# Altium schematic sheet DC075B_CW_OUTPUTS.SchDoc: CW OUTPUTS
size 558 x 431 mm; DrawnBy: Praveen Aroul; DocumentNumber: 12; SheetNumber: 12; SheetTotal: 13; PageSetup: Record=PageOptions|CenterHorizontal=True|CenterVertical=True|PrintScale=1.00|XCorrection=1.00|YCorrection=1.00|PrintKind=0|BorderSize=5000000|LeftOffset=0|BottomOffset=0|Orientation=2|PaperLength=1000|PaperWidth=1000|Scale=100|PaperSource=15|PrintQuality=600|MediaType=1|DitherType=10|PaperKind=Letter|PrintScaleMode=1
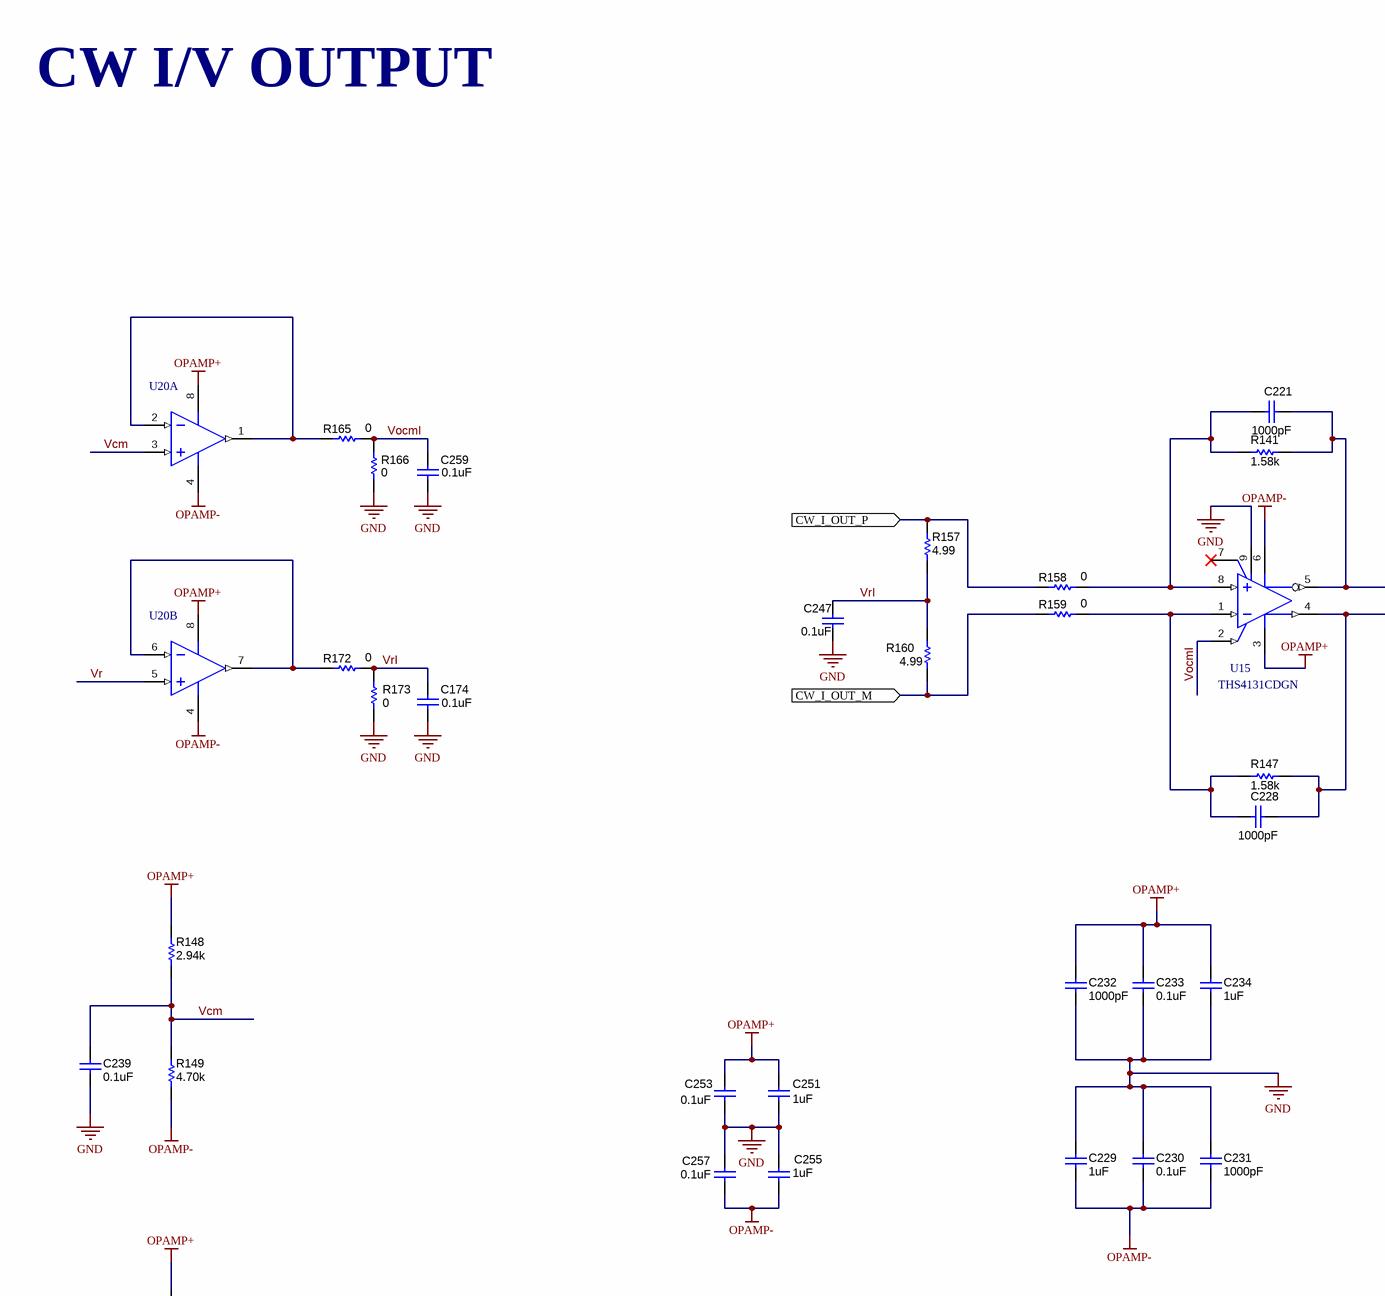
[diagram p0: DC075B_CW_OUTPUTS.SchDoc, top left]
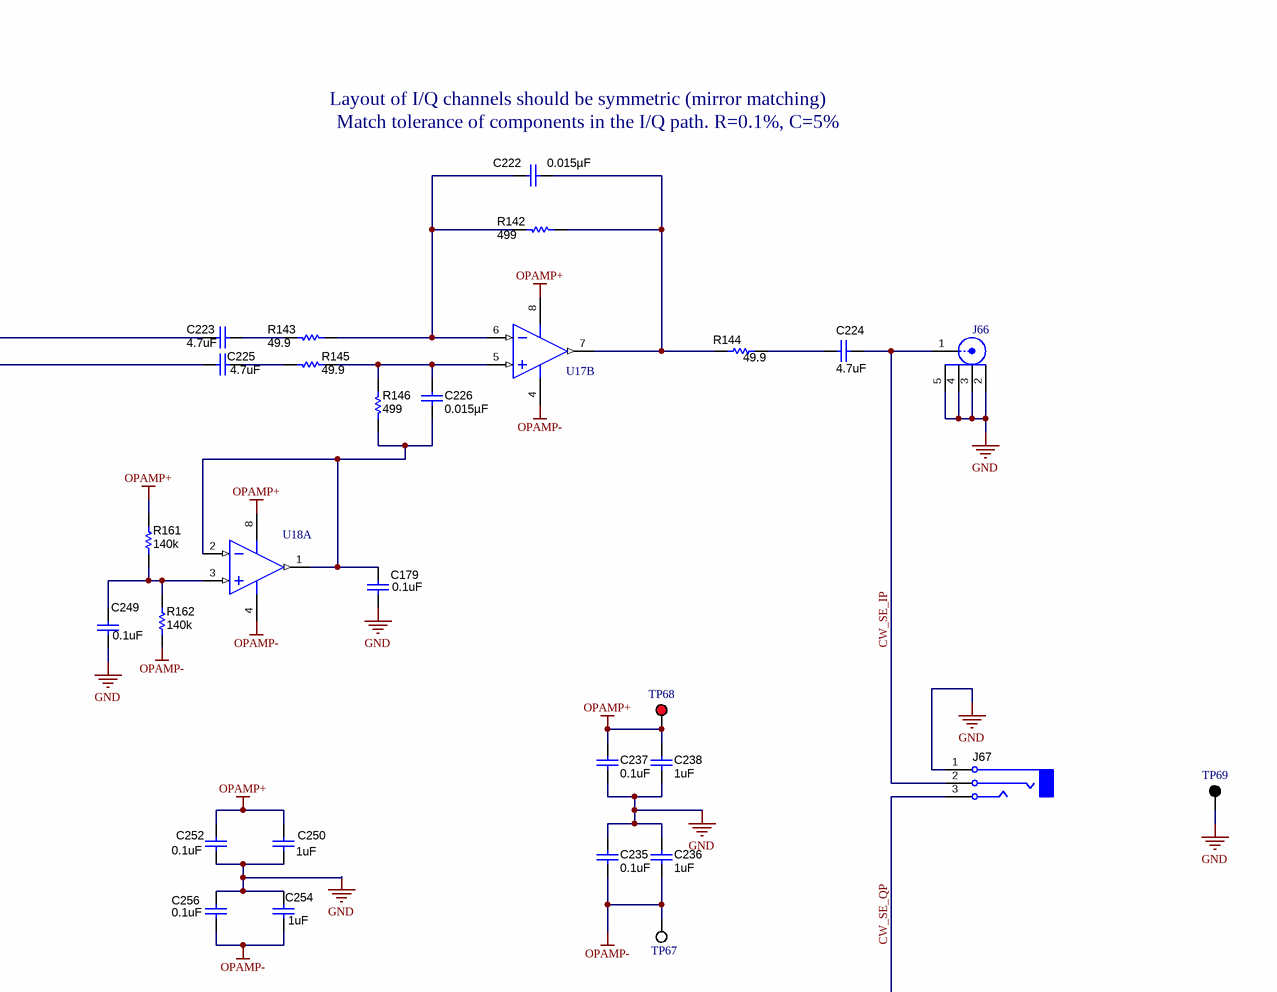
[diagram p1: DC075B_CW_OUTPUTS.SchDoc, top right]
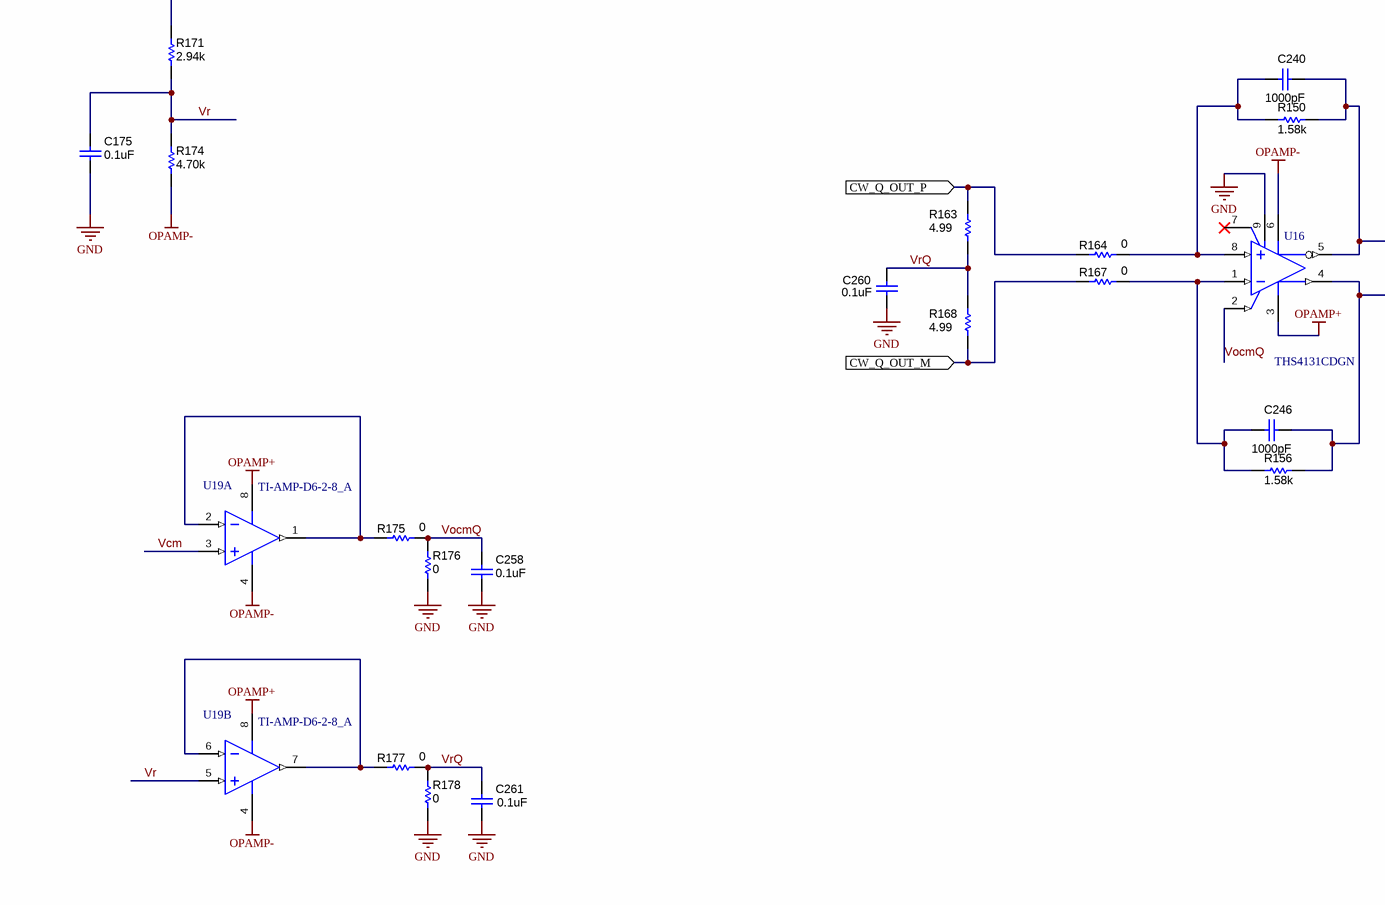
[diagram p2: DC075B_CW_OUTPUTS.SchDoc, bottom left]
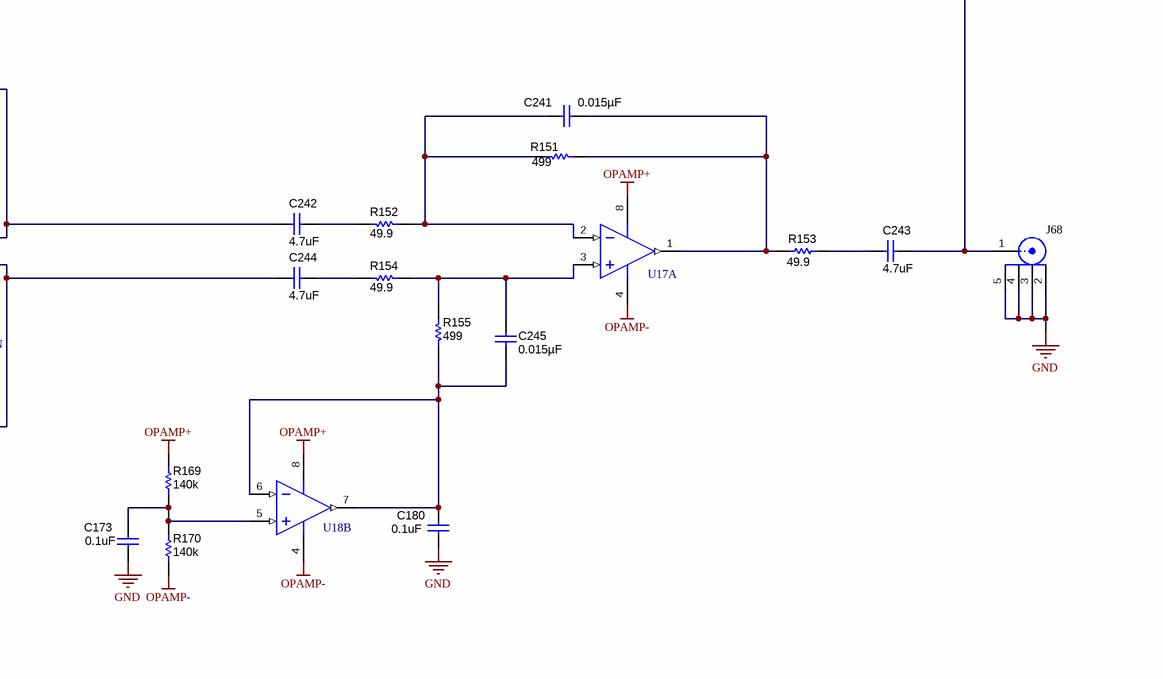
[diagram p3: DC075B_CW_OUTPUTS.SchDoc, bottom right]

## Parts
C173  value 0.1uF  [0402]  (hidden comment: Capacitor)
C174  value 0.1uF  [0402]  (hidden comment: Capacitor)
C175  value 0.1uF  [0402]  (hidden comment: Capacitor)
C179  value 0.1uF  [0402]  (hidden comment: Capacitor)
C180  value 0.1uF  [0402]  (hidden comment: Capacitor)
C221  ValueDisplayed: 1000pF  [0402]  (hidden comment: 885012205044)
C222  ValueDisplayed: 0.015µF  [0402]  (hidden comment: C0402C153J4RAC7867)
C223  ValueDisplayed: 4.7uF  [0603]  (hidden comment: Capacitor)
C224  ValueDisplayed: 4.7uF  [0603]  (hidden comment: Capacitor)
C225  ValueDisplayed: 4.7uF  [0603]  (hidden comment: Capacitor)
C226  ValueDisplayed: 0.015µF  [0402]  (hidden comment: C0402C153J4RAC7867)
C228  ValueDisplayed: 1000pF  [0402]  (hidden comment: 885012205044)
C229  value 1uF  [0603_HV]  (hidden comment: Capacitor)
C230  value 0.1uF  [0402]  (hidden comment: Capacitor)
C231  ValueDisplayed: 1000pF  [0402]  (hidden comment: 885012205044)
C232  ValueDisplayed: 1000pF  [0402]  (hidden comment: 885012205044)
C233  value 0.1uF  [0402]  (hidden comment: Capacitor)
C234  value 1uF  [0603_HV]  (hidden comment: Capacitor)
C235  value 0.1uF  [0402]  (hidden comment: Capacitor)
C236  value 1uF  [0603_HV]  (hidden comment: Capacitor)
C237  value 0.1uF  [0402]  (hidden comment: Capacitor)
C238  value 1uF  [0603_HV]  (hidden comment: Capacitor)
C239  value 0.1uF  [0402]  (hidden comment: Capacitor)
C240  ValueDisplayed: 1000pF  [0402]  (hidden comment: 885012205044)
C241  ValueDisplayed: 0.015µF  [0402]  (hidden comment: C0402C153J4RAC7867)
C242  ValueDisplayed: 4.7uF  [0603]  (hidden comment: Capacitor)
C243  ValueDisplayed: 4.7uF  [0603]  (hidden comment: Capacitor)
C244  ValueDisplayed: 4.7uF  [0603]  (hidden comment: Capacitor)
C245  ValueDisplayed: 0.015µF  [0402]  (hidden comment: C0402C153J4RAC7867)
C246  ValueDisplayed: 1000pF  [0402]  (hidden comment: 885012205044)
C247  value 0.1uF  [0402]  (hidden comment: Capacitor)
C249  value 0.1uF  [0402]  (hidden comment: Capacitor)
C250  value 1uF  [0603_HV]  (hidden comment: Capacitor)
C251  value 1uF  [0603_HV]  (hidden comment: Capacitor)
C252  value 0.1uF  [0402]  (hidden comment: Capacitor)
C253  value 0.1uF  [0402]  (hidden comment: Capacitor)
C254  value 1uF  [0603_HV]  (hidden comment: Capacitor)
C255  value 1uF  [0603_HV]  (hidden comment: Capacitor)
C256  value 0.1uF  [0402]  (hidden comment: Capacitor)
C257  value 0.1uF  [0402]  (hidden comment: Capacitor)
C258  value 0.1uF  [0402]  (hidden comment: Capacitor)
C259  value 0.1uF  [0402]  (hidden comment: Capacitor)
C260  value 0.1uF  [0402]  (hidden comment: Capacitor)
C261  value 0.1uF  [0402]  (hidden comment: Capacitor)
J66  5-1814832-1  [TE_5-1814832-1]  (value not drawn)
J67  Audio_T3R2S1  [KYCON_STX-3000]  (value not drawn)
J68  5-1814832-1  [TE_5-1814832-1]  (value not drawn)
R141  ValueDisplayed: 1.58k  [0402]  (hidden comment: CRCW04021K58FKED)
R142  ValueDisplayed: 499  [0402]  (hidden comment: Resistor)
R143  ValueDisplayed: 49.9  [0402]  (hidden comment: Resistor)
R144  value 49.9  [0402]  (hidden comment: Resistor)
R145  ValueDisplayed: 49.9  [0402]  (hidden comment: Resistor)
R146  ValueDisplayed: 499  [0402]  (hidden comment: Resistor)
R147  ValueDisplayed: 1.58k  [0402]  (hidden comment: CRCW04021K58FKED)
R148  ValueDisplayed: 2.94k  [0402]  (hidden comment: CRCW04022K94FKED)
R149  ValueDisplayed: 4.70k  [0402]  (hidden comment: Resistor)
R150  ValueDisplayed: 1.58k  [0402]  (hidden comment: CRCW04021K58FKED)
R151  ValueDisplayed: 499  [0402]  (hidden comment: Resistor)
R152  ValueDisplayed: 49.9  [0402]  (hidden comment: Resistor)
R153  value 49.9  [0402]  (hidden comment: Resistor)
R154  ValueDisplayed: 49.9  [0402]  (hidden comment: Resistor)
R155  ValueDisplayed: 499  [0402]  (hidden comment: Resistor)
R156  ValueDisplayed: 1.58k  [0402]  (hidden comment: CRCW04021K58FKED)
R157  ValueDisplayed: 4.99  [0402]  (hidden comment: Resistor)
R158  value 0  [0402]  (hidden comment: Resistor)
R159  value 0  [0402]  (hidden comment: Resistor)
R160  ValueDisplayed: 4.99  [0402]  (hidden comment: Resistor)
R161  ValueDisplayed: 140k  [0402]  (hidden comment: Resistor)
R162  ValueDisplayed: 140k  [0402]  (hidden comment: Resistor)
R163  ValueDisplayed: 4.99  [0402]  (hidden comment: Resistor)
R164  value 0  [0402]  (hidden comment: Resistor)
R165  value 0  [0402]  (hidden comment: Resistor)
R166  value 0  [0402]  (hidden comment: Resistor)
R167  value 0  [0402]  (hidden comment: Resistor)
R168  ValueDisplayed: 4.99  [0402]  (hidden comment: Resistor)
R169  ValueDisplayed: 140k  [0402]  (hidden comment: Resistor)
R170  ValueDisplayed: 140k  [0402]  (hidden comment: Resistor)
R171  ValueDisplayed: 2.94k  [0402]  (hidden comment: CRCW04022K94FKED)
R172  value 0  [0402]  (hidden comment: Resistor)
R173  value 0  [0402]  (hidden comment: Resistor)
R174  ValueDisplayed: 4.70k  [0402]  (hidden comment: Resistor)
R175  value 0  [0402]  (hidden comment: Resistor)
R176  value 0  [0402]  (hidden comment: Resistor)
R177  value 0  [0402]  (hidden comment: Resistor)
R178  value 0  [0402]  (hidden comment: Resistor)
TP67  5002  [Keystone5002]  (value not drawn)
TP68  5000  [Keystone5000]  (value not drawn)
TP69  5001  [Keystone5001]  (value not drawn)
U15  THS4131CDGN  [DGN0008D_N]
U16  THS4131CDGN  [DGN0008D_N]
U17  TI-AMP-D6-2-8_A  [D0008A_N]  (value not drawn)  (parts A,B of 2)
U18  TI-AMP-D6-2-8_A  [D0008A_N]  (value not drawn)  (parts A,B of 2)
U19  TI-AMP-D6-2-8_A  [D0008A_N]  (parts A,B of 2)
U20  TI-AMP-D6-2-8_A  [D0008A_N]  (value not drawn)  (parts A,B of 2)

## Ports
CW_I_OUT_M (in), CW_I_OUT_P (in), CW_Q_OUT_M (in), CW_Q_OUT_P (in)

## Nets
GND: C173.1 C174.2 C175.1 C179.2 C180.2 C229.1 C230.1 C231.2 C232.2 C233.1 C234.1 C235.2 C236.2 C237.2 C238.2 C239.1 C247.2 C249.1 C250.2 C251.2 C252.2 C253.2 C254.1 C255.1 C256.1 C257.1 C258.2 C259.2 C260.2 C261.2 J66.2 J66.3 J66.4 J66.5 J67.1(SLEEVE) J68.2 J68.3 J68.4 J68.5 R166.2 R173.2 R176.2 R178.2 TP69.1 U15.9(EP) U16.9(EP)
OPAMP+: C232.1 C233.2 C234.2 C237.1 C238.1 C250.1 C251.1 C252.1 C253.1 R148.2 R161.2 R169.2 R171.2 TP68.1 U15.3(VCC+) U16.3(VCC+) U17.8(VS+) U18.8(VS+) U19.8(VS+) U20.8(VS+)
OPAMP-: C229.2 C230.2 C231.1 C235.1 C236.1 C254.2 C255.2 C256.2 C257.2 R149.1 R162.1 R170.1 R174.1 TP67.1 U15.6(VCC-) U16.6(VCC-) U17.4(VS-) U18.4(VS-) U19.4(VS-) U20.4(VS-)
CW_I_OUT_M: R159.2 R160.1 ; port CW_I_OUT_M
CW_I_OUT_P: R157.2 R158.2 ; port CW_I_OUT_P
CW_Q_OUT_M: R167.2 R168.1 ; port CW_Q_OUT_M
CW_Q_OUT_P: R163.2 R164.2 ; port CW_Q_OUT_P
CW_SE_IP: C224.1 J66.1 J67.2(TIP)
CW_SE_QP: C243.1 J67.3(RING) J68.1
Vcm: C239.2 R148.1 R149.2 U19.3(IN_A+) U20.3(IN_A+)
VocmI: C259.1 R165.1 R166.1 U15.2(VOCM)
VocmQ: C258.1 R175.1 R176.1 U16.2(VOCM)
Vr: C175.2 R171.1 R174.2 U19.5(IN_B+) U20.5(IN_B+)
VrI: C174.1 C247.1 R157.1 R160.2 R172.1 R173.1
VrQ: C260.1 C261.1 R163.1 R168.2 R177.1 R178.1
NetC173_2: C173.2 R169.1 R170.2 U18.5(IN_B+)
NetC179_1: C179.1 C226.1 R146.2 U18.1(OUT_A) U18.2(IN_A-)
NetC180_1: C180.1 C245.1 R155.2 U18.6(IN_B-) U18.7(OUT_B)
NetC221_1: C221.1 C223.2 R141.2 U15.5(VOUT-)
NetC221_2: C221.2 R141.1 R158.1 U15.8(VIN+)
NetC222_1: C222.1 R142.2 R143.2 U17.6(IN_B-)
NetC222_2: C222.2 R142.1 R144.1 U17.7(OUT_B)
NetC223_1: C223.1 R143.1
NetC224_2: C224.2 R144.2
NetC225_1: C225.1 R145.1
NetC225_2: C225.2 C228.1 R147.2 U15.4(VOUT+)
NetC226_2: C226.2 R145.2 R146.1 U17.5(IN_B+)
NetC228_2: C228.2 R147.1 R159.1 U15.1(VIN-)
NetC240_1: C240.1 C242.2 R150.2 U16.5(VOUT-)
NetC240_2: C240.2 R150.1 R164.1 U16.8(VIN+)
NetC241_1: C241.1 R151.1 R153.1 U17.1(OUT_A)
NetC241_2: C241.2 R151.2 R152.2 U17.2(IN_A-)
NetC242_1: C242.1 R152.1
NetC243_2: C243.2 R153.2
NetC244_1: C244.1 R154.1
NetC244_2: C244.2 C246.1 R156.2 U16.4(VOUT+)
NetC245_2: C245.2 R154.2 R155.1 U17.3(IN_A+)
NetC246_2: C246.2 R156.1 R167.1 U16.1(VIN-)
NetC249_2: C249.2 R161.1 R162.2 U18.3(IN_A+)
NetR165_2: R165.2 U20.1(OUT_A) U20.2(IN_A-)
NetR172_2: R172.2 U20.6(IN_B-) U20.7(OUT_B)
NetR175_2: R175.2 U19.1(OUT_A) U19.2(IN_A-)
NetR177_2: R177.2 U19.6(IN_B-) U19.7(OUT_B)

Not connected (* = marked no-connect by the designer): U15 7(NC)*; U16 7(NC)*

## Notes on the sheet
- CW I/V OUTPUT
- Layout of I/Q channels should be symmetric (mirror matching)
- (near C222) Match tolerance of components in the I/Q path. R=0.1%, C=5%
- Drawn By:
- SVN Rev:
- Number:
- TID #:
- Orderable:
- Rev:
- Sheet Title:
- File:
- Project Title:
- Designed for:
- Assembly Variant:
- Mod. Date:
- Sheet:
- Size:
- of
- C
- http://www.ti.com
- Texas Instruments and/or its licensors do not warrant the accuracy or completeness of this specification or any information contained therein. Texas Instruments and/or its licensors do not warrant that this design will meet the specifications, will be suitable for your application or fit for any particular purpose, or will operate in an implementation. Texas Instruments and/or its licensors do not warrant that the design is production worthy. You should completely validate and test your design implementation to confirm the system functionality for your application.
- Engineer:
- Contact:
- © Texas Instruments

## Library data of the parts
C173-C175 C179 C180 C230 C233 C235 C237 C239 C247 C249 C252 C253 C256-C261 = CMP-0006641-2: CAP, CERM, 0.1 uF, 16 V, +/- 10%, X7R, 0402; PartNumber: GRM155R71C104KA88D; Manufacturer: MuRata; Polarized: N; U/M: EA; Cap_F: 100nF; Value1: Unknown; VDC_V: 16V; TaMin_C: -55°C; TaMax_C: 125°C; AEC Category: Q200; SizeArea_mm2: 0.5; SizeAreaWB_mm2: 3; SizeX_mm: 1; SizeZ_mm: 0.6; CompType: Capacitor; PackageReference: 0402; RoHS: Y; MountType: SMT; ComponentLink1Description: Datasheet link; ComponentLink1URL: http://search.murata.co.jp/Ceramy/PnsearchViewAction.do?HnOFG=ON&HnNFG=ON&SEL_CNT=50&sLang=en&sKey=GRM155R71C104KA88D&x=9&y=9&search=startwith; ValueDisplayed: 0.1uF; Tolerance_%: 10%; Value2: 16V; Technology: Ceramic; TempCo: X7R; Cap_Case: 0402; Published: 2008-06-19; Publisher: Texas Instruments; LatestRevisionDate: 2017-03-09; Supplier 1: Digi-Key; Supplier Part Number 1: 490-3261-1-ND; Supplier 2: Newark; Supplier Part Number 2: 38K1647; Supplier 3: Mouser; Supplier Part Number 3: 81-GRM155R71C104KA88; AEC Qualified: ?; SizeY_mm: 0.5
C221 C228 C231 C232 C240 C246 = CMP-0006229-2: CAP, CERM, 1000 pF, 25 V, +/- 10%, X7R, 0402; Manufacturer: Wurth Elektronik; TaMin_C: -55°C; Polarized: N; SizeAreaWB_mm2: 3; Value1: Unknown; U/M: EA; Value: 1000pF; TaMax_C: 125°C; SizeZ_mm: 0.6; SizeX_mm: 1; SizeY_mm: 0.5; Value2: 25V; CompType: Capacitor; Cap_F: 1nF; AEC Category: Q200; Publisher: Texas Instruments; TempCo: X7R; Published: 2008-06-19; RoHS: Y; MountType: SMT; Supplier 1: Mouser; PackageReference: 0402; Tolerance_%: 10%; Cap_Case: 0402; SizeArea_mm2: 0.5; LatestRevisionDate: 2017-03-09; PartNumber: 885012205044; AEC Qualified: N; VDC_V: 25V; ComponentLink1Description: Datasheet link; AEC Grade: N/A; Supplier Part Number 1: 710-885012205044; Technology: Ceramic; ComponentLink1URL: http://katalog.we-online.de/pbs/datasheet/885012205044.pdf
C222 C226 C241 C245 = CMP-0085571-1: CAP, CERM, 0.015 µF, 16 V,+/- 5%, X7R, 0402; Manufacturer: Kemet; Polarized: N; Value: 0.015uF; U/M: EA; Cap_F: 15nF; VDC_V: 16V; TaMin_C: -55°C; TaMax_C: 125°C; SizeArea_mm2: 0.5; SizeAreaWB_mm2: 3; SizeX_mm: 1; SizeZ_mm: 0.6; AEC Category: Q200; CompType: Capacitor; PartNumber: C0402C153J4RAC7867; PackageReference: 0402; RoHS: Y; Tolerance_%: 5%; Value2: 16V; MountType: SMT; Technology: Ceramic; TempCo: X7R; Cap_Case: 0402; ComponentLink1Description: Datasheet link; ComponentLink1URL: https://api.kemet.com/component-edge/download/specsheet/C0402C153J4RACTU.pdf; SizeY_mm: 0.5; AEC Qualified: N; AEC Grade: N/A
C223-C225 C242-C244 = CMP-0006949-5: CAP, CERM, 4.7 uF, 10 V, +/- 10%, X5R, 0603; PartNumber: C0603C475K8PACTU; Manufacturer: Kemet; Polarized: N; Value: 4.7uF; U/M: EA; Cap_F: 4.7µF; ESR_ohm: 6m; Value1: 0.006 ohm; VDC_V: 10V; IRMS_A: 7.24A; TaMin_C: -55°C; TaMax_C: 85°C; AEC Category: Q200; SizeArea_mm2: 1.28; SizeAreaWB_mm2: 4.68; SizeX_mm: 1.6; SizeY_mm: 0.8; SizeZ_mm: 1; CompType: Capacitor; PackageReference: 0603; RoHS: Y; Tolerance_%: 10%; Value2: 10V; MountType: SMT; Technology: Ceramic; TempCo: X5R; Cap_Case: 0603; Published: 2008-06-19; Publisher: Texas Instruments; LatestRevisionDate: 2017-03-09; ComponentLink1Description: Datasheet link; ComponentLink1URL: http://www.kemet.com/kemet/web/homepage/kechome.nsf/vapubfiles/F3102_Y5V.pdf/$file/F3102_Y5V.pdf; Supplier 1: Digi-Key; Supplier Part Number 1: 399-5503-1-ND; Supplier 2: Mouser; Supplier Part Number 2: 80-C0603C475K8P; Supplier 3: Farnell; Supplier Part Number 3: 1572625; AEC Qualified: ?
C229 C234 C236 C238 C250 C251 C254 C255 = CMP-0006868-5: CAP, CERM, 1 uF, 16 V, +/- 10%, X5R, 0603; PartNumber: C0603C105K4PACTU; Manufacturer: Kemet; Polarized: N; U/M: EA; Cap_F: 1µF; Value1: Unknown; VDC_V: 16V; TaMin_C: -55°C; TaMax_C: 85°C; Cap_Case: 0603; AEC Category: Q200; SizeArea_mm2: 1.28; SizeAreaWB_mm2: 4.68; SizeX_mm: 1.6; SizeY_mm: 0.8; SizeZ_mm: 1; CompType: Capacitor; PackageReference: 0603; RoHS: Y; MountType: SMT; ComponentLink1Description: Datasheet link; ComponentLink1URL: http://www.kemet.com/kemet/web/homepage/kechome.nsf/vapubfiles/F3102_Y5V.pdf/$file/F3102_Y5V.pdf; ValueDisplayed: 1uF; Tolerance_%: 10%; Value2: 16V; Technology: Ceramic; TempCo: X5R; Published: 2008-06-19; Publisher: Texas Instruments; LatestRevisionDate: 2017-03-09; Supplier 1: Digi-Key; Supplier Part Number 1: 399-5090-1-ND; Supplier 2: Mouser; Supplier Part Number 2: 80-C0603C105K4P; Supplier 3: Farnell; Supplier Part Number 3: 1288256; AEC Qualified: ?
J66 J68 = CMP-0054990-1: SMA Straight PCB Socket Die Cast, 50 Ohm, TH; Manufacturer: TE Connectivity; Green_Lifecycle: Active; Green_REACh: Passed; CNHeader: FALSE; CT: TRUE; PartNumber: 5-1814832-1; PackageReference: SMA Straight PCB Socket Die Cast, TH; CompType: SMA; RoHS: Y; MountType: TH; ComponentLink1Description: Datasheet URL; ComponentLink1URL: http://www.te.com/commerce/DocumentDelivery/DDEController?Action=srchrtrv&DocNm=1814832&DocType=Customer+Drawing&DocLang=English; Supplier 1: Digi-Key; Supplier Part Number 1: A97594-ND; Supplier 2: Newark; Supplier Part Number 2: 78M7270; Supplier 3: Mouser; Supplier Part Number 3: 571-5-1814832-1; Green_EU RoHS-2: Incomplete; Green_EU RoHS: Passed with Exemption; Publisher: Texas Instruments; LatestRevisionDate: 26/05/2017
J67 = CMP-0075053-1: Audio Jack, 3.5 mm, Stereo, R/A, TH; Manufacturer: Kycon Inc; CompType: Audio Connector; CNHeader: False; CT: True; Green_Lifecycle: Not Set; Green_REACh: Incomplete; PartNumber: STX-3000; PackageReference: Connector, 3-Leads, 3.5mm Stereo Jack R/A, TH; RoHS: Y; MountType: TH; ComponentLink1Description: Datasheet URL; ComponentLink1URL: http://domino2.kycon.com/Pub_Eng_Draw/STX-3000.pdf; Publisher: Texas Instruments; LatestRevisionDate: 2017-07-12; Supplier 1: Mouser; Supplier Part Number 1: 806-STX-3000; Green_EU RoHS-2: Incomplete; Green_EU RoHS: Incomplete
R141 R147 R150 R156 = CMP-0026090-3: RES, 1.58 k, 1%, 0.063 W, AEC-Q200 Grade 0, 0402; Manufacturer: Vishay-Dale; Power_W: 63mW; TempCo: 100 ppm/C; Value_Code: 1k58; Value: 1.58k; EIA_Code: E96; SizeX_mm: 1; SizeY_mm: 0.5; SizeZ_mm: 0.6; Value2: 0.063W; AEC Qualified: Y; VDC_V: 50V; AEC Category: Q200; AEC Grade: 0; Supplier Part Number 2: 52K6578; Supplier 2: Newark; Supplier Part Number 3: 71-CRCW0402-1.58K-E3; Supplier 3: Mouser; RoHS: E; Value1: 1%; MountType: SMT; Supplier 1: Digi-Key; PackageReference: 0402; Tolerance_%: 1%; Res_ohm: 1.58k; SizeArea_mm2: 0.5; CompType: Resistor; PartNumber: CRCW04021K58FKED; ComponentLink1Description: Datasheet link; Supplier Part Number 1: 541-1.58KLCT-ND; Technology: Thick Film; ComponentLink1URL: http://www.vishay.com/docs/20035/dcrcwe3.pdf
R142 R146 R151 R155 = CMP-0026402-2: RES, 499, 1%, 0.063 W, AEC-Q200 Grade 0, 0402; PartNumber: CRCW0402499RFKED; Manufacturer: Vishay-Dale; Value: 499; Value_Code: 499R; Power_W: 63mW; Value2: 0.063W; VDC_V: 50V; TempCo: 100 ppm/C; EIA_Code: E96; AEC Category: Q200; AEC Grade: 0; AEC Qualified: Y; SizeArea_mm2: 0.5; SizeX_mm: 1; SizeZ_mm: 0.6; CompType: Resistor; PackageReference: 0402; RoHS: E; Res_ohm: 499; Tolerance_%: 1%; Value1: 1%; MountType: SMT; Technology: Thick Film; ComponentLink1Description: Datasheet link; ComponentLink1URL: http://www.vishay.com/docs/20035/dcrcwe3.pdf; Supplier 1: Digi-Key; Supplier Part Number 1: 541-499LCT-ND; Supplier 2: Newark; Supplier Part Number 2: 52K7117; Supplier 3: Mouser; Supplier Part Number 3: 71-CRCW0402-499-E3; SizeY_mm: 0.5
R143 R145 R152 R154 = CMP-0026404-2: RES, 49.9, 1%, 0.063 W, AEC-Q200 Grade 0, 0402; PartNumber: CRCW040249R9FKED; Manufacturer: Vishay-Dale; Value: 49.9; Value_Code: 49R9; Power_W: 63mW; Value2: 0.063W; VDC_V: 50V; TempCo: 100 ppm/C; EIA_Code: E96; AEC Category: Q200; AEC Grade: 0; AEC Qualified: Y; SizeArea_mm2: 0.5; SizeX_mm: 1; SizeZ_mm: 0.6; CompType: Resistor; PackageReference: 0402; RoHS: E; Res_ohm: 49.9; Tolerance_%: 1%; Value1: 1%; MountType: SMT; Technology: Thick Film; ComponentLink1Description: Datasheet link; ComponentLink1URL: http://www.vishay.com/docs/20035/dcrcwe3.pdf; Supplier 1: Digi-Key; Supplier Part Number 1: 541-49.9LCT-ND; Supplier 2: Newark; Supplier Part Number 2: 52K7114; Supplier 3: Mouser; Supplier Part Number 3: 71-CRCW0402-49.9-E3; SizeY_mm: 0.5
R144 R153 = CMP-0026404-2: RES, 49.9, 1%, 0.063 W, AEC-Q200 Grade 0, 0402; Manufacturer: Vishay-Dale; PartNumber: CRCW040249R9FKED; Value_Code: 49R9; Power_W: 63mW; Value2: 0.063W; VDC_V: 50V; TempCo: 100 ppm/C; EIA_Code: E96; AEC Category: Q200; AEC Grade: 0; AEC Qualified: Y; SizeArea_mm2: 0.5; SizeX_mm: 1; SizeZ_mm: 0.6; ComponentLink1Description: Datasheet link; ComponentLink1URL: http://www.vishay.com/docs/20035/dcrcwe3.pdf; CompType: Resistor; MountType: SMT; PackageReference: 0402; RoHS: E; ValueDisplayed: 49.9; Res_ohm: 49.9; Tolerance_%: 1%; Value1: 1%; Technology: Thick Film; Supplier 1: Digi-Key; Supplier Part Number 1: 541-49.9LCT-ND; Supplier 2: Newark; Supplier Part Number 2: 52K7114; Supplier 3: Mouser; Supplier Part Number 3: 71-CRCW0402-49.9-E3; SizeY_mm: 0.5
R148 R171 = CMP-0026244-2: RES, 2.94 k, 1%, 0.063 W, AEC-Q200 Grade 0, 0402; Manufacturer: Vishay-Dale; Power_W: 63mW; TempCo: 100 ppm/C; Value_Code: 2k94; Value: 2.94k; EIA_Code: E96; SizeX_mm: 1; SizeY_mm: 0.5; SizeZ_mm: 0.6; Value2: 0.063W; AEC Qualified: Y; VDC_V: 50V; AEC Category: Q200; AEC Grade: 0; ComponentLink1URL: http://www.vishay.com/docs/20035/dcrcwe3.pdf; Supplier Part Number 2: 52K6814; Supplier 2: Newark; Supplier Part Number 3: 71-CRCW0402-2.94K-E3; Supplier 3: Mouser; RoHS: E; Value1: 1%; MountType: SMT; Supplier 1: Digi-Key; PackageReference: 0402; Tolerance_%: 1%; Res_ohm: 2.94k; SizeArea_mm2: 0.5; CompType: Resistor; PartNumber: CRCW04022K94FKED; ComponentLink1Description: Datasheet link; Supplier Part Number 1: 541-2.94KLCT-ND; Technology: Thick Film
R149 R174 = CMP-0026700-1: RES, 4.70 k, 1%, 0.1 W, 0402; PartNumber: ERJ-2RKF4701X; Manufacturer: Panasonic; Value: 4.70k; Res_ohm: 4.7k; Value_Code: 4k70; Power_W: 100mW; Value2: 0.1W; VDC_V: 50V; TempCo: 100 ppm/C; SizeArea_mm2: 0.5; SizeX_mm: 1; SizeZ_mm: 0.6; U/M: EA; AEC Category: Q200; CompType: Resistor; PackageReference: 0402; RoHS: Y; Tolerance_%: 1%; Value1: 1%; MountType: SMT; Technology: Thick Film; SizeY_mm: 0.5; Published: 2008-06-26; Publisher: Texas Instruments; LatestRevisionDate: 2017-03-09; ComponentLink1Description: Datasheet link; ComponentLink1URL: http://industrial.panasonic.com/www-data/pdf/AOA0000/AOA0000CE2.pdf; Supplier 1: Digi-Key; Supplier Part Number 1: P4.70KLCT-ND; Supplier 2: Newark; Supplier Part Number 2: 64R5288; Supplier 3: Mouser; Supplier Part Number 3: 667-ERJ-2RKF4701X; AEC Qualified: ?
R157 R160 R163 R168 = CMP-0026434-2: RES, 4.99, 1%, 0.063 W, AEC-Q200 Grade 0, 0402; PartNumber: CRCW04024R99FKED; Manufacturer: Vishay-Dale; Value: 4.99; Value_Code: 4R99; Power_W: 63mW; Value2: 0.063W; VDC_V: 50V; TempCo: 100 ppm/C; EIA_Code: E96; AEC Category: Q200; AEC Qualified: Y; AEC Grade: 0; SizeArea_mm2: 0.5; SizeX_mm: 1; SizeZ_mm: 0.6; CompType: Resistor; PackageReference: 0402; RoHS: E; Res_ohm: 4.99; Tolerance_%: 1%; Value1: 1%; MountType: SMT; Technology: Thick Film; ComponentLink1Description: Datasheet link; ComponentLink1URL: http://www.vishay.com/docs/20035/dcrcwe3.pdf; Supplier 1: Digi-Key; Supplier Part Number 1: 541-4.99LLCT-ND; Supplier 2: Mouser; Supplier Part Number 2: 71-CRCW0402-4.99-E3; Supplier 3: Farnell; Supplier Part Number 3: 1862028; SizeY_mm: 0.5
R158 R159 R164-R167 R172 R173 R175-R178 = CMP-0026822-3: RES, 0, 5%, 0.063 W, AEC-Q200 Grade 0, 0402; Manufacturer: Vishay-Dale; PartNumber: CRCW04020000Z0ED; Value_Code: 0000; Power_W: 63mW; Value2: 0.063W; VDC_V: 50V; TempCo: 200 ppm/C; EIA_Code: E24; AEC Category: Q200; AEC Qualified: Y; SizeArea_mm2: 0.5; SizeX_mm: 1; SizeZ_mm: 0.6; ComponentLink1Description: Datasheet link; ComponentLink1URL: http://www.vishay.com/docs/20035/dcrcwe3.pdf; CompType: Resistor; MountType: SMT; PackageReference: 0402; RoHS: E; ValueDisplayed: 0; Res_ohm: 0; Tolerance_%: 5%; Value1: 5%; Technology: Thick Film; Supplier 1: Digi-Key; Supplier Part Number 1: 541-0.0JCT-ND; Supplier 2: Newark; Supplier Part Number 2: 52K6543; Supplier 3: Mouser; Supplier Part Number 3: 71-CRCW0402-0-E3; AEC Grade: 0; SizeY_mm: 0.5
R161 R162 R169 R170 = CMP-0026009-3: RES, 140 k, 1%, 0.063 W, AEC-Q200 Grade 0, 0402; PartNumber: CRCW0402140KFKED; Manufacturer: Vishay-Dale; Value: 140k; Power_W: 63mW; Value2: 0.063W; VDC_V: 50V; TempCo: 100 ppm/C; EIA_Code: E96; AEC Category: Q200; AEC Grade: 0; AEC Qualified: Y; SizeArea_mm2: 0.5; SizeX_mm: 1; SizeZ_mm: 0.6; CompType: Resistor; PackageReference: 0402; RoHS: E; Res_ohm: 140k; Value_Code: 140k; Tolerance_%: 1%; Value1: 1%; MountType: SMT; Technology: Thick Film; ComponentLink1Description: Datasheet link; ComponentLink1URL: http://www.vishay.com/docs/20035/dcrcwe3.pdf; Supplier 1: Digi-Key; Supplier Part Number 1: 541-140KLCT-ND; Supplier 2: Newark; Supplier Part Number 2: 52K6697; Supplier 3: Mouser; Supplier Part Number 3: 71-CRCW0402-140K-E3; SizeY_mm: 0.5
TP67 = CMP-0055139-1: Test Point, Miniature, White, TH; Manufacturer: Keystone; CNHeader: FALSE; ContactFinish: Silver; CT: TRUE; Green_Lifecycle: Active; Green_REACh: Passed; PartNumber: 5002; PackageReference: White Miniature Testpoint; CompType: Test Point; RoHS: Y; MountType: TH; ComponentLink1Description: Datasheet URL; ComponentLink1URL: http://www.keyelco.com/userAssets/file/M60-2p60.pdf; Publisher: Texas Instruments; LatestRevisionDate: 26/05/2017; Supplier 1: Digi-Key; Supplier Part Number 1: 36-5002-ND; Supplier 2: Newark; Supplier Part Number 2: 82H9632; Supplier 3: Mouser; Supplier Part Number 3: 534-5002; Color: White; Green_EU RoHS-2: Passed; Green_EU RoHS: Passed
TP68 = CMP-0055137-1: Test Point, Miniature, Red, TH; Manufacturer: Keystone; CNHeader: FALSE; ContactFinish: Silver; CT: TRUE; Green_Lifecycle: Active; Green_REACh: Passed; PartNumber: 5000; PackageReference: Red Miniature Testpoint; CompType: Test Point; RoHS: Y; MountType: TH; ComponentLink1Description: Datasheet URL; ComponentLink1URL: http://www.keyelco.com/userAssets/file/M60-2p60.pdf; Publisher: Texas Instruments; LatestRevisionDate: 26/05/2017; Supplier 1: Digi-Key; Supplier Part Number 1: 36-5000-ND; Supplier 2: Mouser; Supplier Part Number 2: 534-5000; Color: Red; Green_EU RoHS-2: Incomplete; Green_EU RoHS: Passed
TP69 = CMP-0055138-1: Test Point, Miniature, Black, TH; Manufacturer: Keystone; CNHeader: FALSE; ContactFinish: Silver; CT: TRUE; Green_Lifecycle: Active; Green_REACh: Passed; PartNumber: 5001; PackageReference: Black Miniature Testpoint; CompType: Test Point; RoHS: Y; MountType: TH; ComponentLink1Description: Datasheet URL; ComponentLink1URL: http://www.keyelco.com/userAssets/file/M60-2p60.pdf; Publisher: Texas Instruments; LatestRevisionDate: 26/05/2017; Supplier 1: Digi-Key; Supplier Part Number 1: 36-5001-ND; Supplier 2: Mouser; Supplier Part Number 2: 534-5001; Color: Black; Green_EU RoHS-2: Incomplete; Green_EU RoHS: Passed
U15 U16 = CMP-0039778-1: Fully Differential Input / Output Low Noise Amplifier, 5 to 30 V, 0 to 70 degC, 8-pin SOP (DGN8), Green (RoHS & no Sb/Br); Manufacturer: Texas Instruments; Settling Time (0.1%)(Typ)(ns): 78; Slew Rate(Typ)(V/us): 52; BW @ Acl(MHz): 150; Offset Voltage Drift (+/-)(Max)(uV/Degrees Celsius: 4.5; THD (Fc is 1 MHz)(Typ)(dB): -80; SubFamily: Fully Differential Amplifier; Iq per channel(Max)(mA): 16; Vn at Flatband(Typ)(nV/rtHz): 1.3; Vs(Max)(V): 30; 3rd Harmonic(dBc): 82; Vio(Max)(mV): 2; Number of Channels: 1; 2nd Harmonic(dBc): 88; Io(Typ)(mA): 85; Vs(Min)(V): 5; DatasheetVersion: SLOS318H; Code_JEDEC: MO-187; ComponentLink1Description: Manufacturer URL; ComponentLink1URL: http://www.ti.com/; PackageReference: DGN0008D; ComponentLink3URL: http://www.ti.com/litv/pdf/mpds046e; PartNumber: THS4131CDGN; ComponentLink2URL: http://www.ti.com/general/docs/lit/getliterature.tsp?genericPartNumber=THS4131&fileType=pdf; Mounting Technology: Surface Mount; Eco-Plan: Green (RoHS & no Sb/Br); @ MHz: 1; ComponentLink3Description: Package Specification; PackageDescription: 8-Pin Plastic Small Outline, Body 3 x 3 mm, Pitch 0.65 mm; PackageVersion: 4073271/F, 05/2011; ComponentLink2Description: Datasheet
U17-U20 = CMP-0039949-1: Dual, High Gain Bandwidth, High Output Current, Operational Amplifier with Current Limit, 5 to 12 V, -40 to 85 degC, 8-pin SOIC (D8), Green (RoHS & no Sb/Br); Manufacturer: Texas Instruments; PartNumber: OPA2614ID; 2nd Harmonic(dBc): 92; 3rd Harmonic(dBc): 110; @ MHz: 1; Acl, min stable gain(V/V): 2; BW @ Acl(MHz): 180; Iib(Max)(nA): 14500; Io(Typ)(mA): 350; Iq per channel(Max)(mA): 6.5; Settling Time (0.1%)(Typ)(ns): 35; Slew Rate(Typ)(V/us): 145; Sub Family: High Output Current Amplifier (>=50mA), High Speed Amplifier (>=50MHz); THD (Fc is 1 MHz)(Typ)(dB): -75; Vn at Flatband(Typ)(nV/rtHz): 1.8; Vs(Max)(V): 12; Vs(Min)(V): 5; DatasheetVersion: SBOS305D; PackageVersion: 4040047-3/M, 06/2011; PackageReference: D0008A; PackageDescription: 8-Pin Plastic Small Outline, Body 4.9 x 3.9 mm, Pitch 1.27 mm; Eco-Plan: Green (RoHS & no Sb/Br); Number of Channels: 2; Vio(Max)(mV): 1; Code_JEDEC: MS-012; ComponentLink1Description: Manufacturer URL; ComponentLink1URL: http://www.ti.com/; ComponentLink2Description: Datasheet; ComponentLink2URL: http://www.ti.com/general/docs/lit/getliterature.tsp?genericPartNumber=OPA2614&fileType=pdf; ComponentLink3Description: Package Specification; ComponentLink3URL: http://www.ti.com/litv/pdf/msoi002j; Mounting Technology: Surface Mount